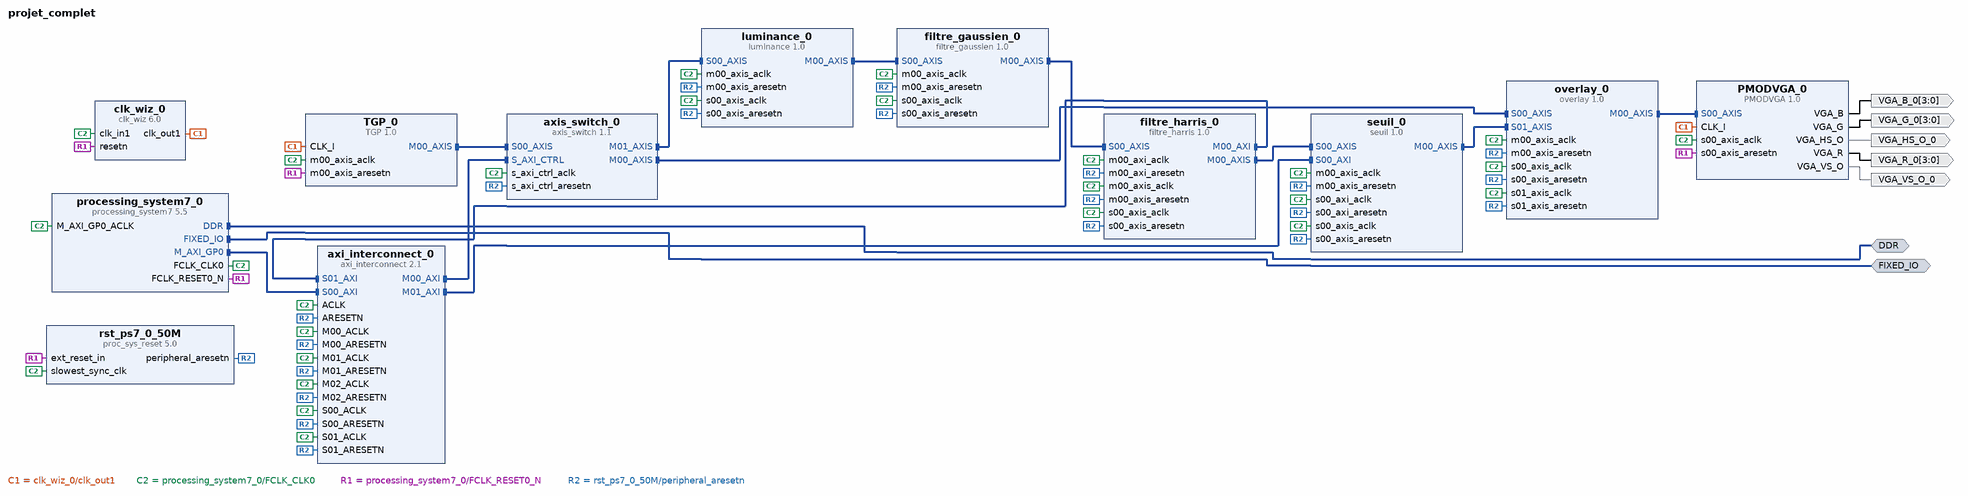
[diagram p0: block diagram of the top level]
# Vivado block design projet_complet, xc7z010clg400-3, Vivado 2020.2
create_bd_design projet_complet

create_bd_intf_port -mode Master -vlnv xilinx.com:interface:ddrx_rtl:1.0 DDR
create_bd_intf_port -mode Master -vlnv xilinx.com:display_processing_system7:fixedio_rtl:1.0 FIXED_IO
create_bd_port -dir O -from 3 -to 0 VGA_R_0
create_bd_port -dir O -from 3 -to 0 VGA_B_0
create_bd_port -dir O VGA_VS_O_0
create_bd_port -dir O VGA_HS_O_0
create_bd_port -dir O -from 3 -to 0 VGA_G_0

create_bd_cell -type ip -vlnv xilinx.com:ip:processing_system7:5.5 processing_system7_0
set_property -dict {CONFIG.PCW_S_AXI_HP0_DATA_WIDTH 32 CONFIG.PCW_USE_S_AXI_HP0 1} [get_bd_cells processing_system7_0]
# 2 more settings of processing_system7_0 are not shown: defaults, MIO pin electricals, DDR timing, and values the tool derives
create_bd_cell -type ip -vlnv xilinx.com:user:PMODVGA:1.0 PMODVGA_0
create_bd_cell -type ip -vlnv xilinx.com:user:TGP:1.0 TGP_0
create_bd_cell -type ip -vlnv xilinx.com:ip:clk_wiz:6.0 clk_wiz_0
set_property -dict [list \
  CONFIG.CLKIN1_JITTER_PS 200.0 \
  CONFIG.CLKOUT1_DRIVES BUFG \
  CONFIG.CLKOUT1_JITTER 386.663 \
  CONFIG.CLKOUT1_PHASE_ERROR 261.747 \
  CONFIG.CLKOUT1_REQUESTED_OUT_FREQ 25.000 \
  CONFIG.CLKOUT2_DRIVES BUFG \
  CONFIG.CLKOUT3_DRIVES BUFG \
  CONFIG.CLKOUT4_DRIVES BUFG \
  CONFIG.CLKOUT5_DRIVES BUFG \
  CONFIG.CLKOUT6_DRIVES BUFG \
  CONFIG.CLKOUT7_DRIVES BUFG \
  CONFIG.FEEDBACK_SOURCE FDBK_AUTO \
  CONFIG.MMCM_BANDWIDTH OPTIMIZED \
  CONFIG.MMCM_CLKFBOUT_MULT_F 33 \
  CONFIG.MMCM_CLKIN1_PERIOD 20.000 \
  CONFIG.MMCM_CLKOUT0_DIVIDE_F 33 \
  CONFIG.MMCM_COMPENSATION ZHOLD \
  CONFIG.MMCM_DIVCLK_DIVIDE 2 \
  CONFIG.PLL_CLKIN_PERIOD 20.000 \
  CONFIG.PRIMITIVE PLL \
  CONFIG.PRIM_IN_FREQ 50.000 \
  CONFIG.RESET_PORT resetn \
  CONFIG.RESET_TYPE ACTIVE_LOW \
  CONFIG.USE_LOCKED false \
] [get_bd_cells clk_wiz_0]
create_bd_cell -type ip -vlnv xilinx.com:ip:axi_interconnect:2.1 axi_interconnect_0
set_property -dict {CONFIG.NUM_MI 3 CONFIG.NUM_SI 2} [get_bd_cells axi_interconnect_0]
create_bd_cell -type ip -vlnv xilinx.com:ip:proc_sys_reset:5.0 rst_ps7_0_50M
create_bd_cell -type ip -vlnv xilinx.com:user:filtre_gaussien:1.0 filtre_gaussien_0
create_bd_cell -type ip -vlnv xilinx.com:user:filtre_harris:1.0 filtre_harris_0
create_bd_cell -type ip -vlnv xilinx.com:user:seuil:1.0 seuil_0
create_bd_cell -type ip -vlnv xilinx.com:user:luminance:1.0 luminance_0
create_bd_cell -type ip -vlnv xilinx.com:user:overlay:1.0 overlay_0
create_bd_cell -type ip -vlnv xilinx.com:ip:axis_switch:1.1 axis_switch_0
set_property -dict {CONFIG.DECODER_REG 1 CONFIG.NUM_MI 2 CONFIG.NUM_SI 2 CONFIG.ROUTING_MODE 1} [get_bd_cells axis_switch_0]

# ---- connections ----

connect_bd_intf_net [get_bd_intf_pins luminance_0/M00_AXIS] [get_bd_intf_pins filtre_gaussien_0/S00_AXIS]
connect_bd_intf_net [get_bd_intf_pins seuil_0/M00_AXIS] [get_bd_intf_pins overlay_0/S01_AXIS]
connect_bd_intf_net [get_bd_intf_ports DDR] [get_bd_intf_pins processing_system7_0/DDR]
connect_bd_intf_net [get_bd_intf_ports FIXED_IO] [get_bd_intf_pins processing_system7_0/FIXED_IO]
connect_bd_intf_net [get_bd_intf_pins axis_switch_0/M00_AXIS] [get_bd_intf_pins overlay_0/S00_AXIS]
connect_bd_intf_net [get_bd_intf_pins filtre_harris_0/M00_AXIS] [get_bd_intf_pins seuil_0/S00_AXIS]
connect_bd_intf_net [get_bd_intf_pins filtre_harris_0/M00_AXI] [get_bd_intf_pins axi_interconnect_0/S01_AXI]
connect_bd_intf_net [get_bd_intf_pins axi_interconnect_0/S00_AXI] [get_bd_intf_pins processing_system7_0/M_AXI_GP0]
connect_bd_intf_net [get_bd_intf_pins seuil_0/S00_AXI] [get_bd_intf_pins axi_interconnect_0/M01_AXI]
connect_bd_intf_net [get_bd_intf_pins filtre_gaussien_0/M00_AXIS] [get_bd_intf_pins filtre_harris_0/S00_AXIS]
connect_bd_intf_net [get_bd_intf_pins PMODVGA_0/S00_AXIS] [get_bd_intf_pins overlay_0/M00_AXIS]
connect_bd_intf_net [get_bd_intf_pins TGP_0/M00_AXIS] [get_bd_intf_pins axis_switch_0/S00_AXIS]
connect_bd_intf_net [get_bd_intf_pins axi_interconnect_0/M00_AXI] [get_bd_intf_pins axis_switch_0/S_AXI_CTRL]
connect_bd_intf_net [get_bd_intf_pins luminance_0/S00_AXIS] [get_bd_intf_pins axis_switch_0/M01_AXIS]
connect_bd_net [get_bd_pins clk_wiz_0/clk_out1] [get_bd_pins TGP_0/CLK_I] [get_bd_pins PMODVGA_0/CLK_I]
connect_bd_net [get_bd_pins PMODVGA_0/VGA_R] [get_bd_ports VGA_R_0]
connect_bd_net [get_bd_pins PMODVGA_0/VGA_B] [get_bd_ports VGA_B_0]
connect_bd_net [get_bd_pins PMODVGA_0/VGA_VS_O] [get_bd_ports VGA_VS_O_0]
connect_bd_net [get_bd_pins PMODVGA_0/VGA_HS_O] [get_bd_ports VGA_HS_O_0]
connect_bd_net [get_bd_pins PMODVGA_0/VGA_G] [get_bd_ports VGA_G_0]
connect_bd_net [get_bd_pins processing_system7_0/FCLK_CLK0] \
  [get_bd_pins clk_wiz_0/clk_in1] [get_bd_pins processing_system7_0/M_AXI_GP0_ACLK] [get_bd_pins axi_interconnect_0/ACLK] \
  [get_bd_pins rst_ps7_0_50M/slowest_sync_clk] [get_bd_pins PMODVGA_0/s00_axis_aclk] [get_bd_pins TGP_0/m00_axis_aclk] \
  [get_bd_pins axi_interconnect_0/S00_ACLK] [get_bd_pins axi_interconnect_0/M00_ACLK] \
  [get_bd_pins axi_interconnect_0/M01_ACLK] [get_bd_pins seuil_0/s00_axi_aclk] [get_bd_pins filtre_gaussien_0/m00_axis_aclk] \
  [get_bd_pins filtre_harris_0/s00_axis_aclk] [get_bd_pins filtre_gaussien_0/s00_axis_aclk] \
  [get_bd_pins luminance_0/m00_axis_aclk] [get_bd_pins filtre_harris_0/m00_axi_aclk] \
  [get_bd_pins axi_interconnect_0/S01_ACLK] [get_bd_pins filtre_harris_0/m00_axis_aclk] [get_bd_pins seuil_0/s00_axis_aclk] \
  [get_bd_pins luminance_0/s00_axis_aclk] [get_bd_pins overlay_0/m00_axis_aclk] [get_bd_pins overlay_0/s01_axis_aclk] \
  [get_bd_pins seuil_0/m00_axis_aclk] [get_bd_pins overlay_0/s00_axis_aclk] [get_bd_pins axis_switch_0/s_axi_ctrl_aclk] \
  [get_bd_pins axi_interconnect_0/M02_ACLK]
connect_bd_net [get_bd_pins processing_system7_0/FCLK_RESET0_N] \
  [get_bd_pins rst_ps7_0_50M/ext_reset_in] [get_bd_pins clk_wiz_0/resetn] [get_bd_pins TGP_0/m00_axis_aresetn] \
  [get_bd_pins PMODVGA_0/s00_axis_aresetn]
connect_bd_net [get_bd_pins rst_ps7_0_50M/peripheral_aresetn] \
  [get_bd_pins axi_interconnect_0/ARESETN] [get_bd_pins axi_interconnect_0/S00_ARESETN] \
  [get_bd_pins axi_interconnect_0/M00_ARESETN] [get_bd_pins axi_interconnect_0/M01_ARESETN] \
  [get_bd_pins seuil_0/s00_axi_aresetn] [get_bd_pins filtre_gaussien_0/m00_axis_aresetn] \
  [get_bd_pins filtre_harris_0/s00_axis_aresetn] [get_bd_pins filtre_gaussien_0/s00_axis_aresetn] \
  [get_bd_pins luminance_0/m00_axis_aresetn] [get_bd_pins filtre_harris_0/m00_axi_aresetn] \
  [get_bd_pins axi_interconnect_0/S01_ARESETN] [get_bd_pins filtre_harris_0/m00_axis_aresetn] \
  [get_bd_pins seuil_0/s00_axis_aresetn] [get_bd_pins luminance_0/s00_axis_aresetn] [get_bd_pins overlay_0/m00_axis_aresetn] \
  [get_bd_pins overlay_0/s01_axis_aresetn] [get_bd_pins seuil_0/m00_axis_aresetn] [get_bd_pins overlay_0/s00_axis_aresetn] \
  [get_bd_pins axis_switch_0/s_axi_ctrl_aresetn] [get_bd_pins axi_interconnect_0/M02_ARESETN]

# ---- address map ----
assign_bd_address -offset 0x43C00000 -range 64K -target_address_space [get_bd_addr_spaces filtre_harris_0/M00_AXI] [get_bd_addr_segs seuil_0/S00_AXI/S00_AXI_reg]
assign_bd_address -offset 0x43C10000 -range 64K -target_address_space [get_bd_addr_spaces filtre_harris_0/M00_AXI] [get_bd_addr_segs axis_switch_0/S_AXI_CTRL/Reg]
assign_bd_address -offset 0x43C00000 -range 64K -target_address_space [get_bd_addr_spaces processing_system7_0/Data] [get_bd_addr_segs seuil_0/S00_AXI/S00_AXI_reg]
assign_bd_address -offset 0x43C10000 -range 64K -target_address_space [get_bd_addr_spaces processing_system7_0/Data] [get_bd_addr_segs axis_switch_0/S_AXI_CTRL/Reg]

validate_bd_design
save_bd_design
